# Altium schematic sheet Mother Board Core Interface.SchDoc
size A4
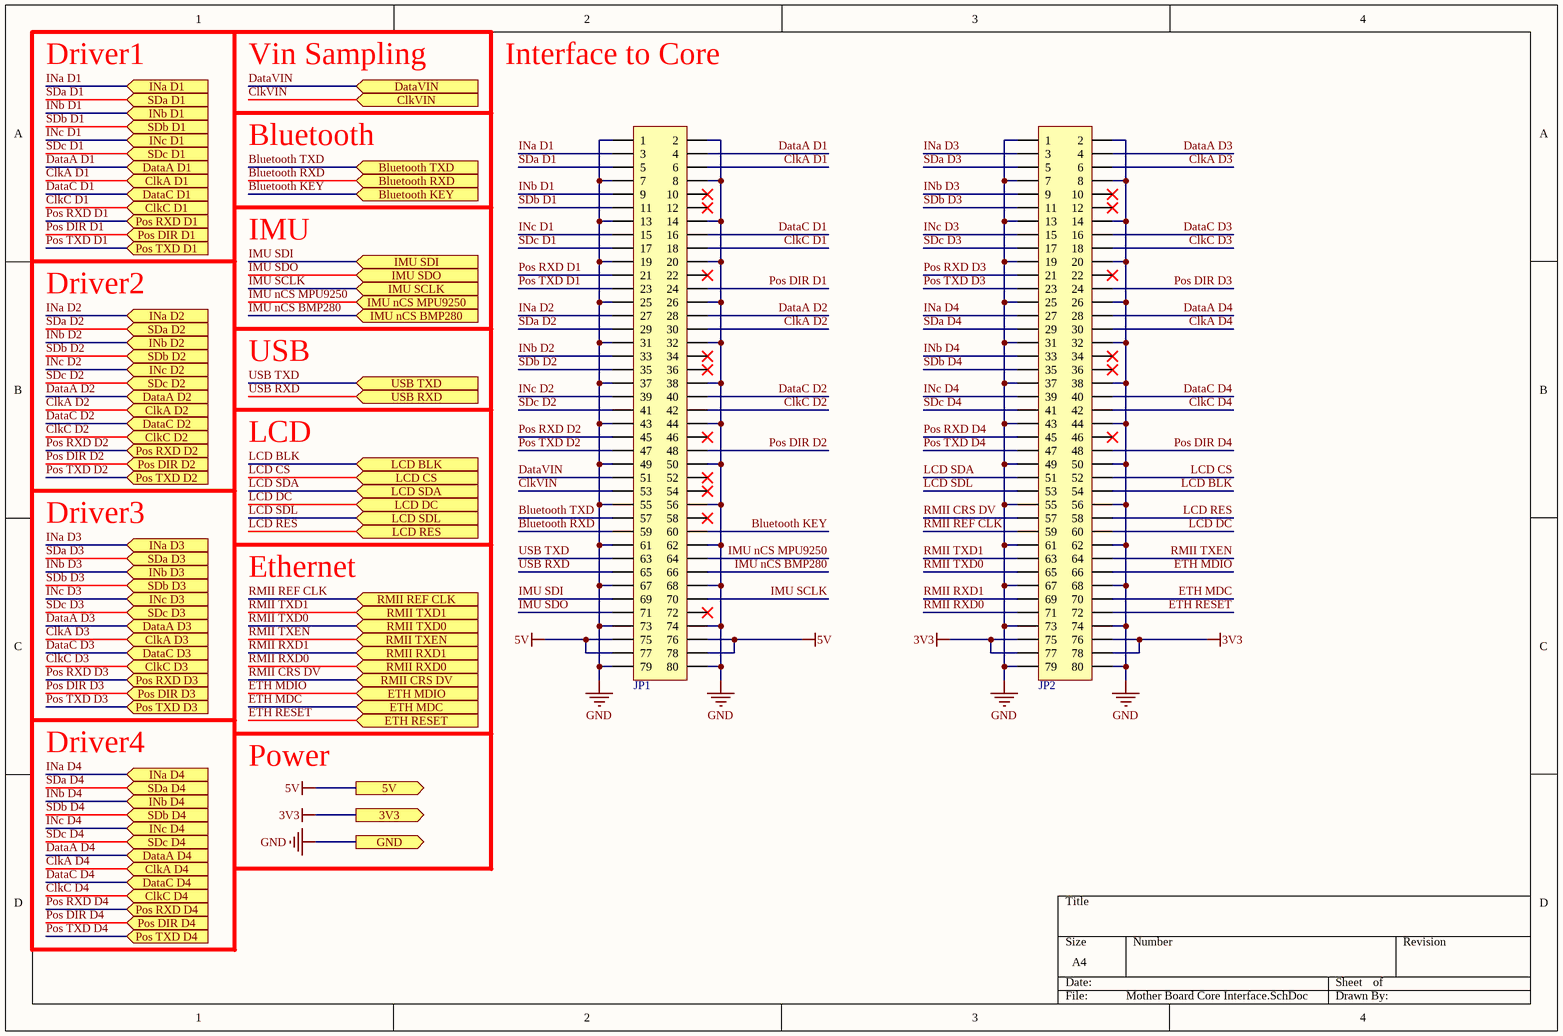
[diagram p0: Mother Board Core Interface.SchDoc]

## Parts
JP1  Header 40PX2  [HEADER_0.8mm_2x40P_G]  (value not drawn)
JP2  Header 40PX2  [HEADER_0.8mm_2x40P_G]  (value not drawn)

## Ports
3V3 (out), 5V (out), Bluetooth KEY (in), Bluetooth RXD (in), Bluetooth TXD (in), ClkA D1 (in), ClkA D2 (in), ClkA D3 (in), ClkA D4 (in), ClkC D1 (in), ClkC D2 (in), ClkC D3 (in), ClkC D4 (in), ClkVIN (in), DataA D1 (in), DataA D2 (in), DataA D3 (in), DataA D4 (in), DataC D1 (in), DataC D2 (in), DataC D3 (in), DataC D4 (in), DataVIN (in), ETH MDC (in), ETH MDIO (in), ETH RESET (in), GND (out), IMU nCS BMP280 (in), IMU nCS MPU9250 (in), IMU SCLK (in), IMU SDI (in), IMU SDO (in), INa D1 (in), INa D2 (in), INa D3 (in), INa D4 (in), INb D1 (in), INb D2 (in), INb D3 (in), INb D4 (in), INc D1 (in), INc D2 (in), INc D3 (in), INc D4 (in), LCD BLK (in), LCD CS (in), LCD DC (in), LCD RES (in), LCD SDA (in), LCD SDL (in), Pos DIR D1 (in), Pos DIR D2 (in), Pos DIR D3 (in), Pos DIR D4 (in), Pos RXD D1 (in), Pos RXD D2 (in), Pos RXD D3 (in), Pos RXD D4 (in), Pos TXD D1 (in), Pos TXD D2 (in), Pos TXD D3 (in), Pos TXD D4 (in), RMII CRS DV (in), RMII REF CLK (in), RMII RXD0 (in), RMII RXD1 (in), RMII TXD0 (in), RMII TXD1 (in), RMII TXEN (in), SDa D1 (in), SDa D2 (in), SDa D3 (in), SDa D4 (in), SDb D1 (in), SDb D2 (in), SDb D3 (in), SDb D4 (in), SDc D1 (in), SDc D2 (in), SDc D3 (in), SDc D4 (in), USB RXD (in), USB TXD (in)

## Nets
3V3: JP2.75 JP2.76 JP2.77 JP2.78 ; port 3V3
5V: JP1.75 JP1.76 JP1.77 JP1.78 ; port 5V
GND: JP1.1 JP1.2 JP1.7 JP1.8 JP1.13 JP1.14 JP1.19 JP1.20 JP1.25 JP1.26 JP1.31 JP1.32 JP1.37 JP1.38 JP1.43 JP1.44 JP1.49 JP1.50 JP1.55 JP1.56 JP1.61 JP1.62 JP1.67 JP1.68 JP1.73 JP1.74 JP1.79 JP1.80 JP2.1 JP2.2 JP2.7 JP2.8 JP2.13 JP2.14 JP2.19 JP2.20 JP2.25 JP2.26 JP2.31 JP2.32 JP2.37 JP2.38 JP2.43 JP2.44 JP2.49 JP2.50 JP2.55 JP2.56 JP2.61 JP2.62 JP2.67 JP2.68 JP2.73 JP2.74 JP2.79 JP2.80 ; port GND
Bluetooth KEY: JP1.60 ; port Bluetooth KEY
Bluetooth RXD: JP1.59 ; port Bluetooth RXD
Bluetooth TXD: JP1.57 ; port Bluetooth TXD
ClkA D1: JP1.6 ; port ClkA D1
ClkA D2: JP1.30 ; port ClkA D2
ClkA D3: JP2.6 ; port ClkA D3
ClkA D4: JP2.30 ; port ClkA D4
ClkC D1: JP1.18 ; port ClkC D1
ClkC D2: JP1.42 ; port ClkC D2
ClkC D3: JP2.18 ; port ClkC D3
ClkC D4: JP2.42 ; port ClkC D4
ClkVIN: JP1.53 ; port ClkVIN
DataA D1: JP1.4 ; port DataA D1
DataA D2: JP1.28 ; port DataA D2
DataA D3: JP2.4 ; port DataA D3
DataA D4: JP2.28 ; port DataA D4
DataC D1: JP1.16 ; port DataC D1
DataC D2: JP1.40 ; port DataC D2
DataC D3: JP2.16 ; port DataC D3
DataC D4: JP2.40 ; port DataC D4
DataVIN: JP1.51 ; port DataVIN
ETH MDC: JP2.70 ; port ETH MDC
ETH MDIO: JP2.66 ; port ETH MDIO
ETH RESET: JP2.72 ; port ETH RESET
IMU nCS BMP280: JP1.66 ; port IMU nCS BMP280
IMU nCS MPU9250: JP1.64 ; port IMU nCS MPU9250
IMU SCLK: JP1.70 ; port IMU SCLK
IMU SDI: JP1.69 ; port IMU SDI
IMU SDO: JP1.71 ; port IMU SDO
INa D1: JP1.3 ; port INa D1
INa D2: JP1.27 ; port INa D2
INa D3: JP2.3 ; port INa D3
INa D4: JP2.27 ; port INa D4
INb D1: JP1.9 ; port INb D1
INb D2: JP1.33 ; port INb D2
INb D3: JP2.9 ; port INb D3
INb D4: JP2.33 ; port INb D4
INc D1: JP1.15 ; port INc D1
INc D2: JP1.39 ; port INc D2
INc D3: JP2.15 ; port INc D3
INc D4: JP2.39 ; port INc D4
LCD BLK: JP2.54 ; port LCD BLK
LCD CS: JP2.52 ; port LCD CS
LCD DC: JP2.60 ; port LCD DC
LCD RES: JP2.58 ; port LCD RES
LCD SDA: JP2.51 ; port LCD SDA
LCD SDL: JP2.53 ; port LCD SDL
Pos DIR D1: JP1.24 ; port Pos DIR D1
Pos DIR D2: JP1.48 ; port Pos DIR D2
Pos DIR D3: JP2.24 ; port Pos DIR D3
Pos DIR D4: JP2.48 ; port Pos DIR D4
Pos RXD D1: JP1.21 ; port Pos RXD D1
Pos RXD D2: JP1.45 ; port Pos RXD D2
Pos RXD D3: JP2.21 ; port Pos RXD D3
Pos RXD D4: JP2.45 ; port Pos RXD D4
Pos TXD D1: JP1.23 ; port Pos TXD D1
Pos TXD D2: JP1.47 ; port Pos TXD D2
Pos TXD D3: JP2.23 ; port Pos TXD D3
Pos TXD D4: JP2.47 ; port Pos TXD D4
RMII CRS DV: JP2.57 ; port RMII CRS DV
RMII REF CLK: JP2.59 ; port RMII REF CLK
RMII RXD0: JP2.71 ; port RMII RXD0
RMII RXD1: JP2.69 ; port RMII RXD1
RMII TXD0: JP2.65 ; port RMII TXD0
RMII TXD1: JP2.63 ; port RMII TXD1
RMII TXEN: JP2.64 ; port RMII TXEN
SDa D1: JP1.5 ; port SDa D1
SDa D2: JP1.29 ; port SDa D2
SDa D3: JP2.5 ; port SDa D3
SDa D4: JP2.29 ; port SDa D4
SDb D1: JP1.11 ; port SDb D1
SDb D2: JP1.35 ; port SDb D2
SDb D3: JP2.11 ; port SDb D3
SDb D4: JP2.35 ; port SDb D4
SDc D1: JP1.17 ; port SDc D1
SDc D2: JP1.41 ; port SDc D2
SDc D3: JP2.17 ; port SDc D3
SDc D4: JP2.41 ; port SDc D4
USB RXD: JP1.65 ; port USB RXD
USB TXD: JP1.63 ; port USB TXD

Not connected (* = marked no-connect by the designer): JP1 10* 12* 22* 34* 36* 46* 52* 54* 58* 72*; JP2 10* 12* 22* 34* 36* 46*

## Notes on the sheet
- Driver1
- Vin Sampling
- Interface to Core
- Bluetooth
- IMU
- Driver2
- USB
- LCD
- Driver3
- Ethernet
- Driver4
- Power

## Library data of the parts
JP1 JP2 = Header 40PX2: 40*2P接插件; BOM名称: 20*2P接插件; 版权归属: 源创客; 学习资源: www.ooocke.com